# Altium schematic sheet [01] - COVER PAGE.SchDoc
size A3; DocumentNumber: 1; SheetNumber: 1; SheetTotal: 4; Organization: Altium Limited; Address1: L3, 12a Rodborough Rd; Address2: Frenchs Forest; Address3: NSW; Address4: Australia 2086
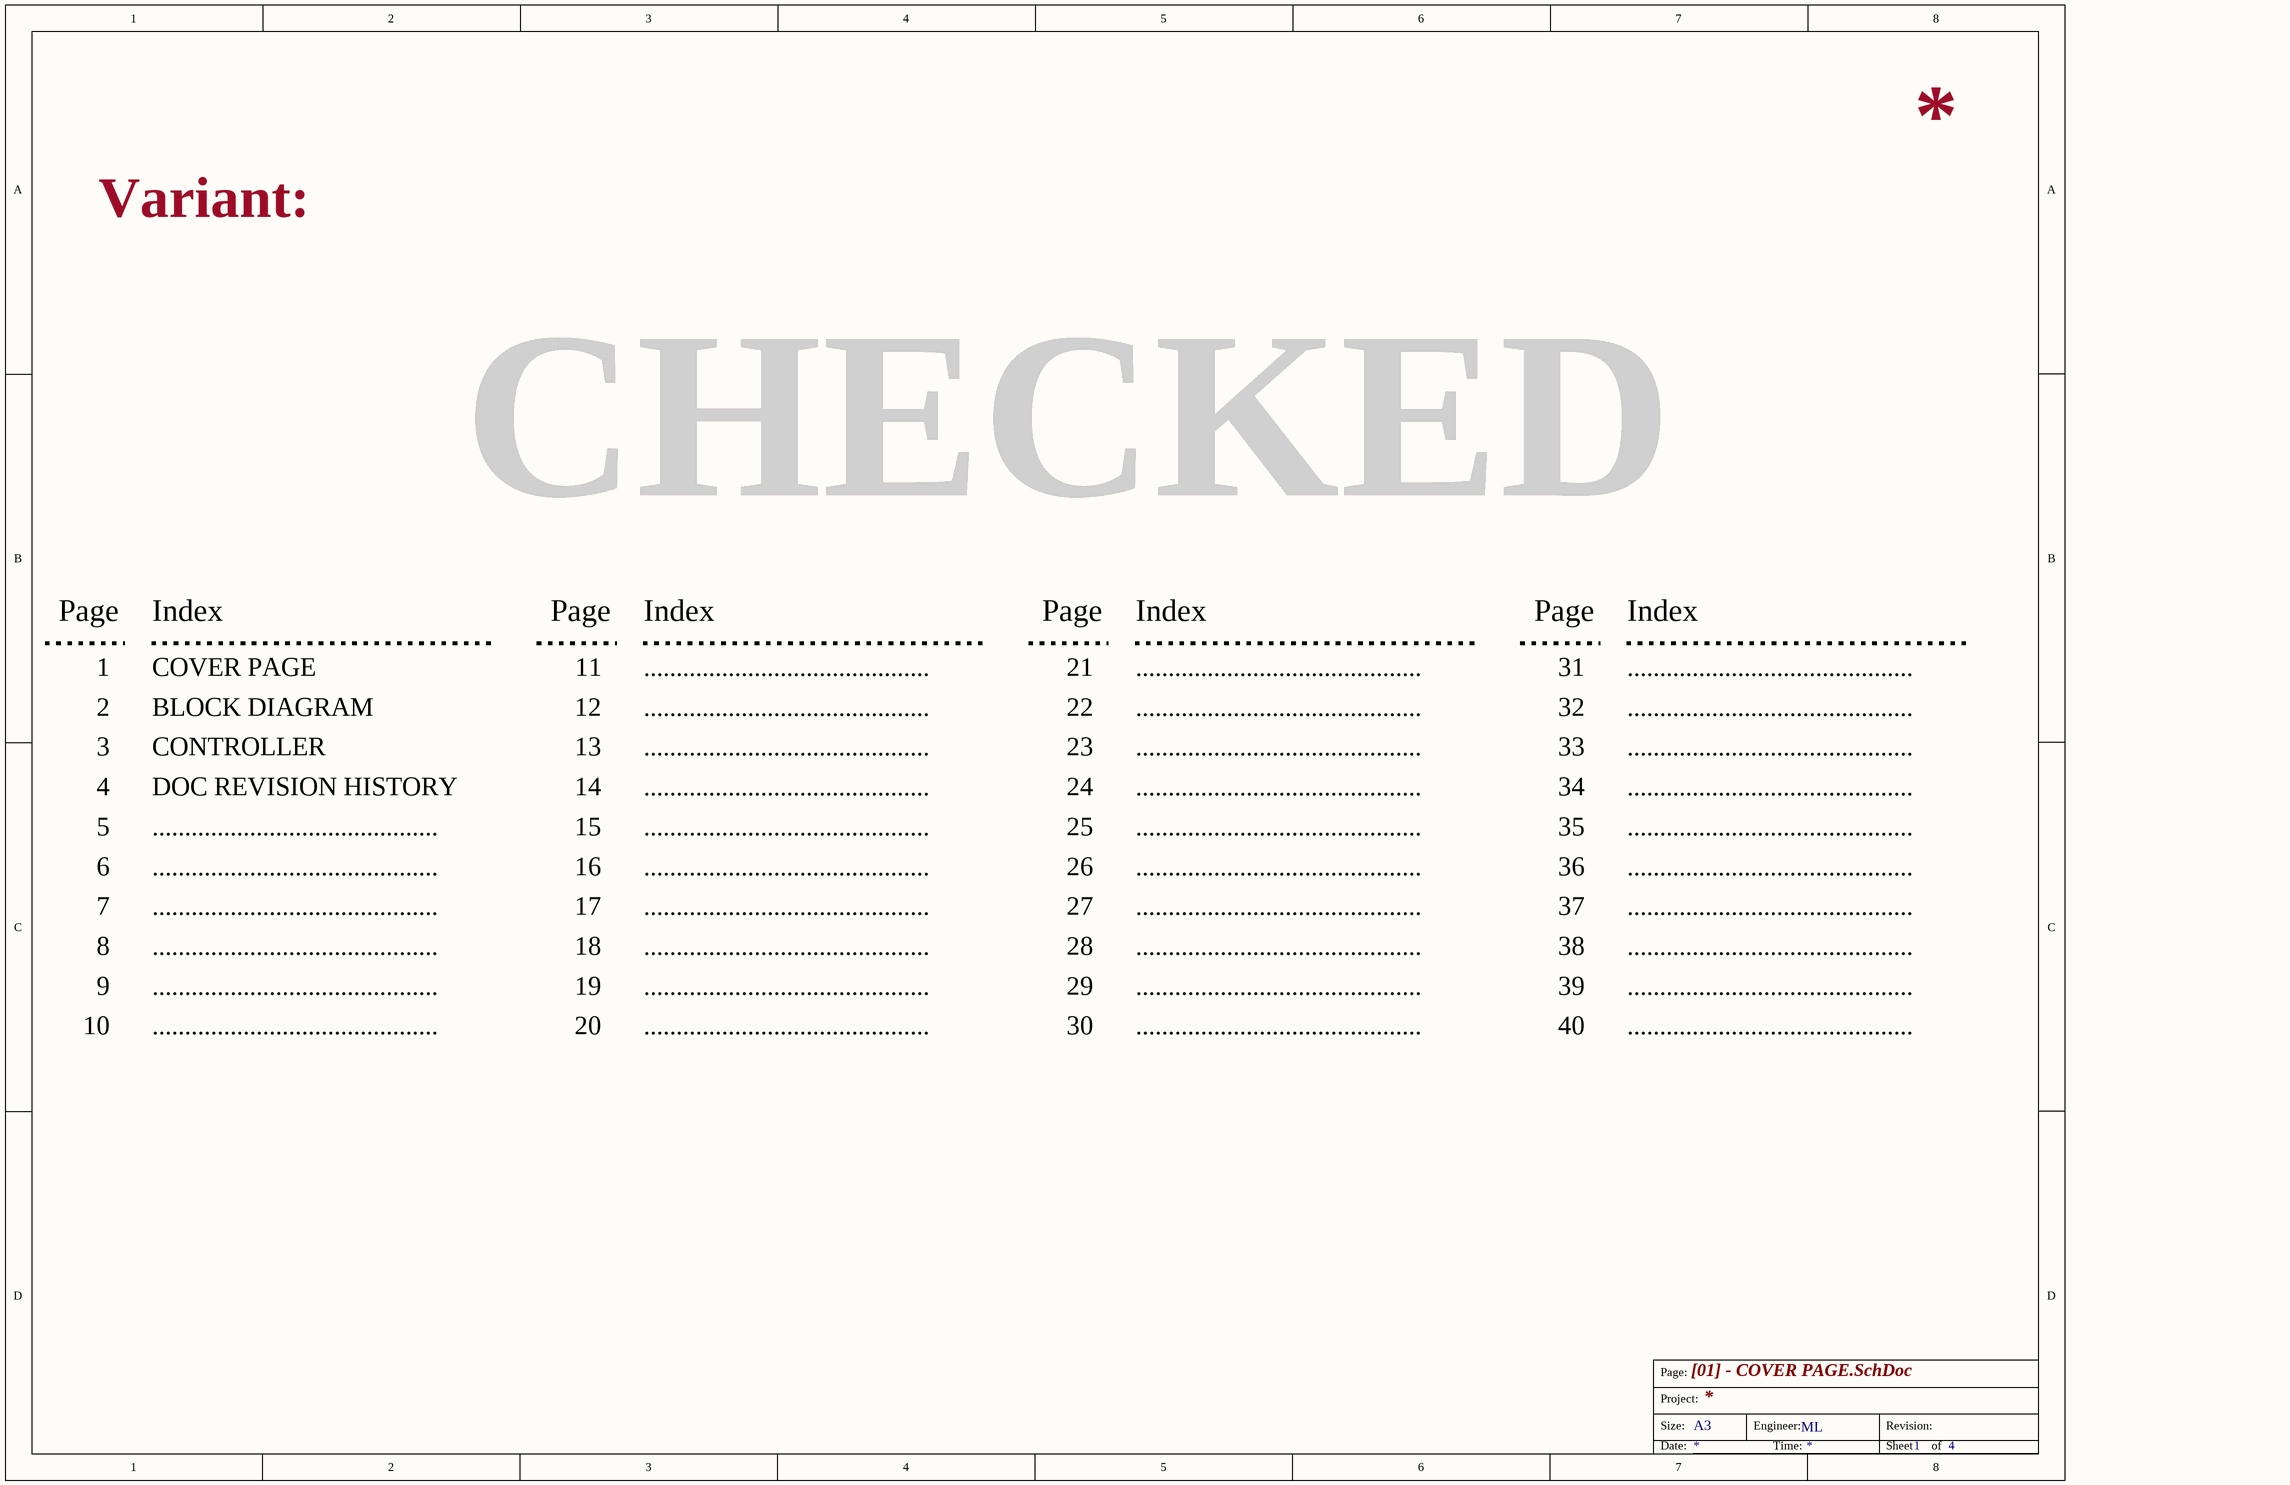
[diagram p0: [01] - COVER PAGE.SchDoc]

## Notes on the sheet
- Variant:
- CHECKED
- Page
- Index
- 1
- COVER PAGE
- 11
- ............................................
- 21
- 31
- 2
- 3
- BLOCK DIAGRAM
- CONTROLLER
- 12
- 13
- 22
- 23
- 32
- 33
- 4
- 5
- DOC REVISION HISTORY
- 14
- 15
- 24
- 25
- 34
- 35
- 6
- 16
- 26
- 36
- 7
- 8
- 17
- 18
- 27
- 28
- 37
- 38
- 9
- 10
- 19
- 20
- 29
- 30
- 39
- 40
- Page:
- Size:
- Project:
- A3
- Engineer:
- ML
- Revision:
- Date:
- Time:
- Sheet
- of